# EAGLE design hybrid (EAGLE 7.7.0)

## Sheet 1 of 2
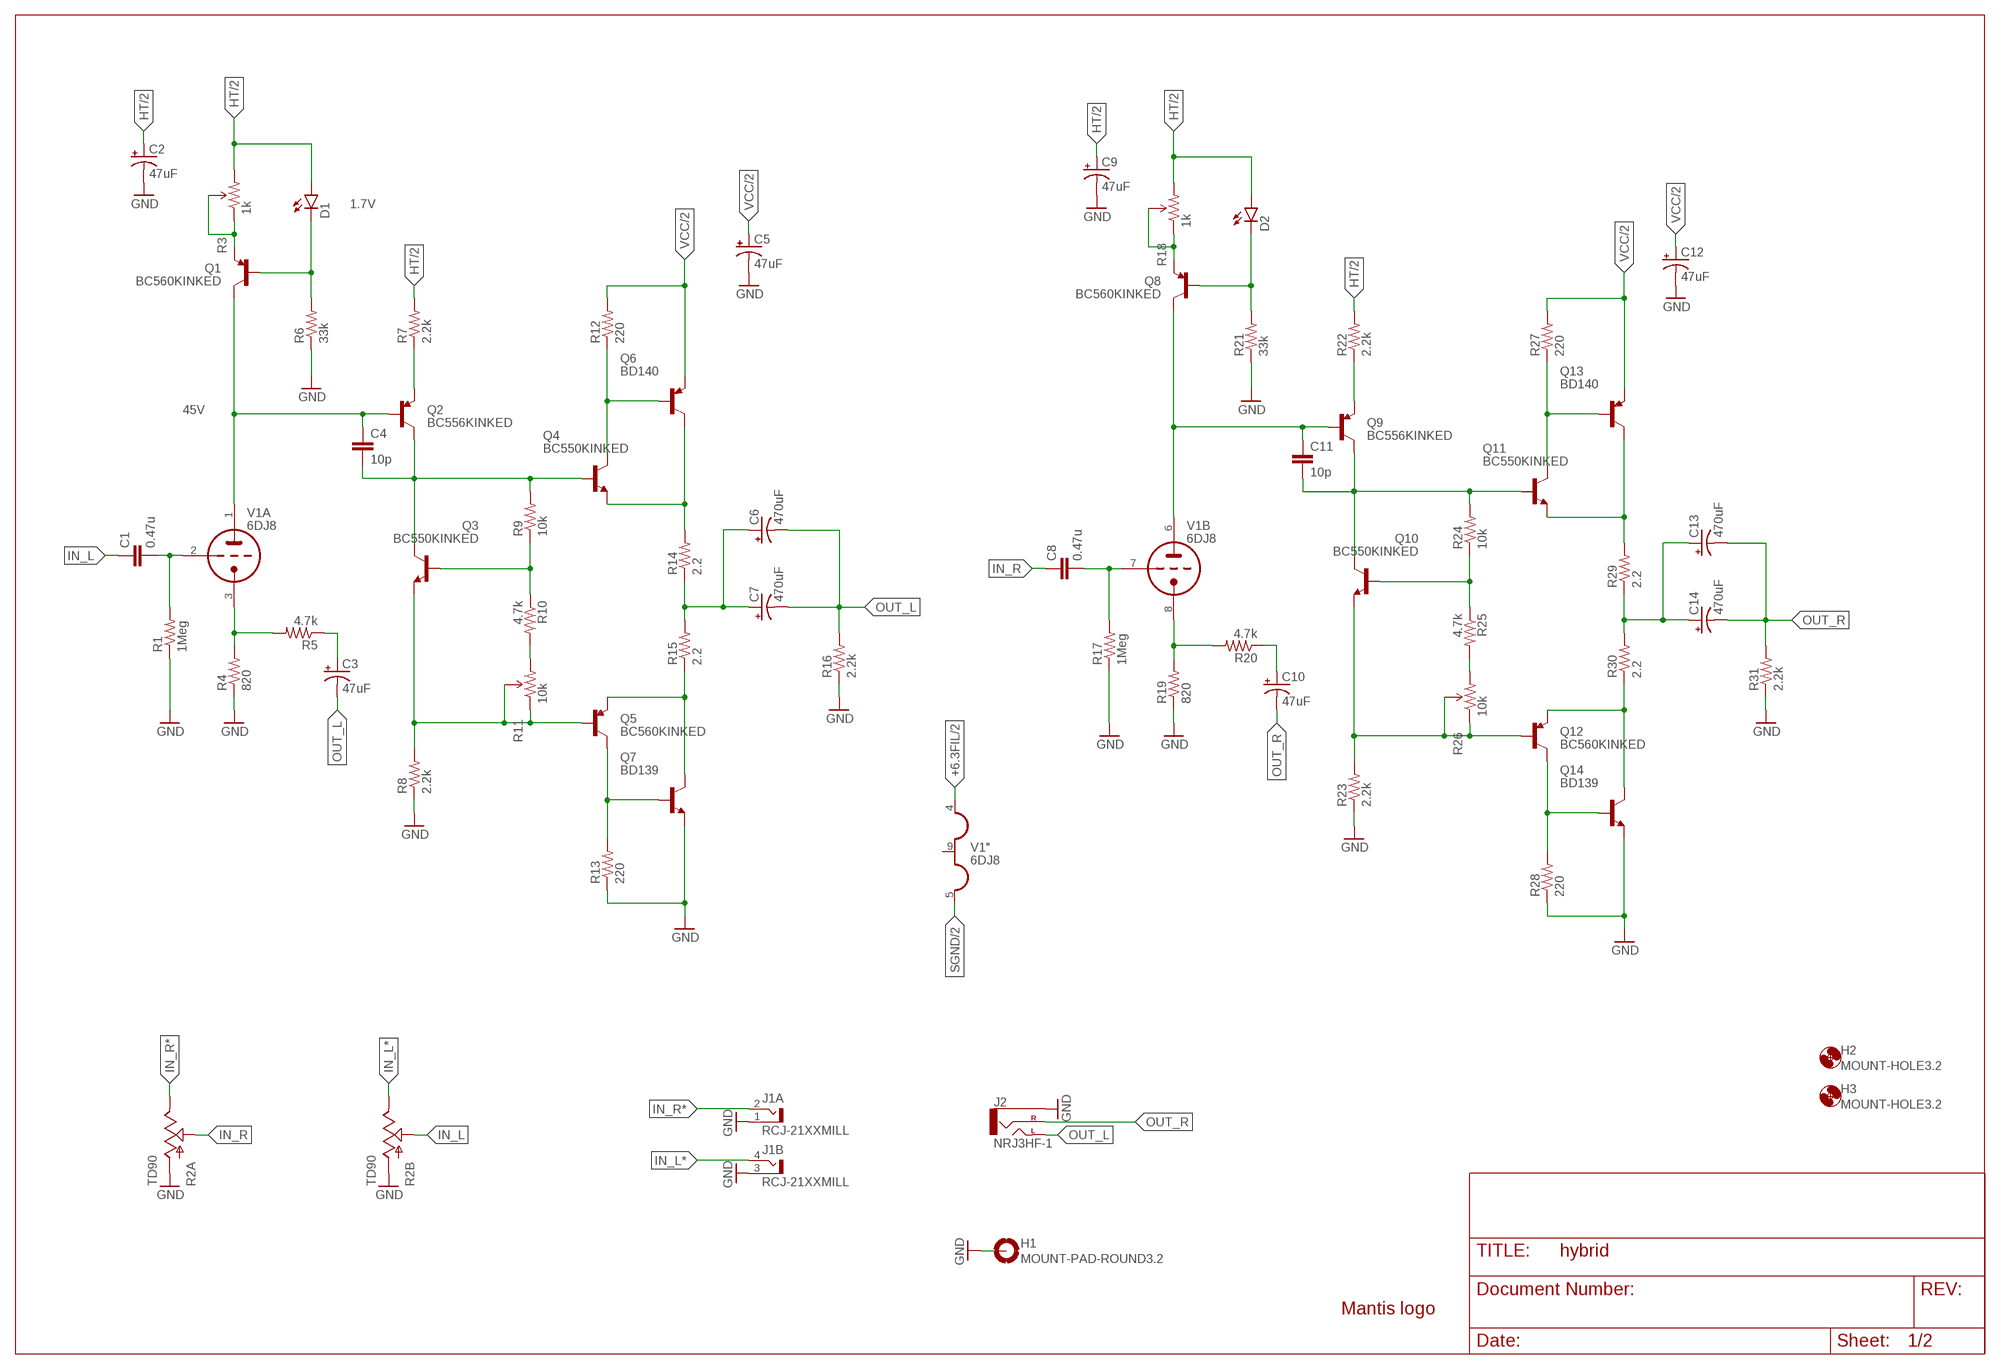
[diagram p0: schematic, sheet 1]

### Parts
C1  0.47u  C5/3.5  [C5B3.5]
C2  47uF  CAP_POLPTH-8/3.5  [CPOL-RADIAL-8/3.5]
C3  47uF  CAP_POLPTH-8/3.5  [CPOL-RADIAL-8/3.5]
C4  10p  CAPPTH  [CAP-PTH-SMALL]
C5  47uF  CAP_POLPTH-8/3.5  [CPOL-RADIAL-8/3.5]
C6  470uF  CAP_POLPTH-12/5  [CPOL-RADIAL-12/5]
C7  470uF  CAP_POLPTH-12/5  [CPOL-RADIAL-12/5]
C8  0.47u  C5/3.5  [C5B3.5]
C9  47uF  CAP_POLPTH-8/3.5  [CPOL-RADIAL-8/3.5]
C10  47uF  CAP_POLPTH-8/3.5  [CPOL-RADIAL-8/3.5]
C11  10p  CAPPTH  [CAP-PTH-SMALL]
C12  47uF  CAP_POLPTH-8/3.5  [CPOL-RADIAL-8/3.5]
C13  470uF  CAP_POLPTH-12/5  [CPOL-RADIAL-12/5]
C14  470uF  CAP_POLPTH-12/5  [CPOL-RADIAL-12/5]
D1  LED3MM  [LED3MM]
D2  LED3MM  [LED3MM]
H1  MOUNT-PAD-ROUND3.2  [3,2-PAD]
H2  MOUNT-HOLE3.2  [3,2]
H3  MOUNT-HOLE3.2  [3,2]
J1  RCJ-21XXMILL  [RCJ-21-MILL]
J2  NRJ3HF-1  [NRJ3HF]
LOGO1  LOGO-MANTIS  [LOGO-MANTIS]
Q1  BC560KINKED  [TO92-BENT]
Q2  BC556KINKED  [TO92-BENT]
Q3  BC550KINKED  [TO92-BENT]
Q4  BC550KINKED  [TO92-BENT]
Q5  BC560KINKED  [TO92-BENT]
Q6  BD140  [TO126]
Q7  BD139  [TO126]
Q8  BC560KINKED  [TO92-BENT]
Q9  BC556KINKED  [TO92-BENT]
Q10  BC550KINKED  [TO92-BENT]
Q11  BC550KINKED  [TO92-BENT]
Q12  BC560KINKED  [TO92-BENT]
Q13  BD140  [TO126]
Q14  BD139  [TO126]
R1  1Meg  RESISTORPTH-1/4W  [AXIAL-0.4]
R2  TD90  [PTD902]
R3  1k  TRIMPOT3362U-2  [3362U-2]
R4  820  RESISTORPTH-1/4W  [AXIAL-0.4]
R5  4.7k  RESISTORPTH-1/4W  [AXIAL-0.4]
R6  33k  RESISTORPTH-1/4W  [AXIAL-0.4]
R7  2.2k  RESISTORPTH-1/4W  [AXIAL-0.4]
R8  2.2k  RESISTORPTH-1/4W  [AXIAL-0.4]
R9  10k  RESISTORPTH-1/4W  [AXIAL-0.4]
R10  4.7k  RESISTORPTH-1/4W  [AXIAL-0.4]
R11  10k  TRIMPOT3362U-2  [3362U-2]
R12  220  RESISTORPTH-1/4W  [AXIAL-0.4]
R13  220  RESISTORPTH-1/4W  [AXIAL-0.4]
R14  2.2  RESISTORPTH-1/2W  [AXIAL-0.5]
R15  2.2  RESISTORPTH-1/2W  [AXIAL-0.5]
R16  2.2k  RESISTORPTH-1/4W  [AXIAL-0.4]
R17  1Meg  RESISTORPTH-1/4W  [AXIAL-0.4]
R18  1k  TRIMPOT3362U-2  [3362U-2]
R19  820  RESISTORPTH-1/4W  [AXIAL-0.4]
R20  4.7k  RESISTORPTH-1/4W  [AXIAL-0.4]
R21  33k  RESISTORPTH-1/4W  [AXIAL-0.4]
R22  2.2k  RESISTORPTH-1/4W  [AXIAL-0.4]
R23  2.2k  RESISTORPTH-1/4W  [AXIAL-0.4]
R24  10k  RESISTORPTH-1/4W  [AXIAL-0.4]
R25  4.7k  RESISTORPTH-1/4W  [AXIAL-0.4]
R26  10k  TRIMPOT3362U-2  [3362U-2]
R27  220  RESISTORPTH-1/4W  [AXIAL-0.4]
R28  220  RESISTORPTH-1/4W  [AXIAL-0.4]
R29  2.2  RESISTORPTH-1/2W  [AXIAL-0.5]
R30  2.2  RESISTORPTH-1/2W  [AXIAL-0.5]
R31  2.2k  RESISTORPTH-1/4W  [AXIAL-0.4]
V1  6DJ8  6DJ8-P  [NOVAL]

### Nets
+6.3FIL [pwr]: V1.4(":H1) ; also sheet 2
CAT_L: R4.P$2 R5.P$2 V1.3(A:TK)
CAT_R: R19.P$2 R20.P$2 V1.8(B:TK)
FB_L [out]: C6.+ C7.+ R14.P$1 R15.P$2
FB_R [out]: C13.+ C14.+ R29.P$1 R30.P$2
GND: C2.2(-) C5.2(-) C9.2(-) C12.2(-) H1.B3,2(MOUNT) J1.1(A:S) J1.3(B:S) J2.S(SLEEVE) Q7.1(E) Q14.1(E) R1.P$1 R2.R1.1(A:A) R2.R2.1(B:A) R4.P$1 R6.P$1 R8.P$1 R13.P$1 R16.P$1 R17.P$1 R19.P$1 R21.P$1 R23.P$1 R28.P$1 R31.P$1 ; also sheet 2
HT [pwr]: C2.1(+) C9.1(+) D1.A D2.A R3.3(CW) R7.P$2 R18.3(CW) R22.P$2 ; also sheet 2
IN_L: C1.1 R2.R2.2(B:S)
IN_L*: J1.4(B:T) R2.R2.3(B:E)
IN_R: C8.1 R2.R1.2(A:S)
IN_R*: J1.2(A:T) R2.R1.3(A:E)
N$2: Q1.3(E) R3.1(CCW) R3.2(WIPER)
N$3: D1.K(C) Q1.2(B) R6.P$2
N$4: C3.1(+) R5.P$1
N$5: Q2.3(E) R7.P$1
N$7: C4.2 Q2.1(C) Q3.1(C) Q4.2(B) R9.P$2
N$8: Q3.2(B) R9.P$1 R10.P$1
N$9: C1.2 R1.P$2 V1.2(A:TG)
N$10: R10.P$2 R11.3(CW)
N$11 [out]: Q4.3(E) Q6.2(C) R14.P$2
N$12: Q3.3(E) Q5.2(B) R8.P$2 R11.1(CCW) R11.2(WIPER)
N$13 [out]: Q5.3(E) Q7.2(C) R15.P$1
N$14: Q4.1(C) Q6.3(B) R12.P$1
N$15: Q5.1(C) Q7.3(B) R13.P$2
N$16: Q8.3(E) R18.1(CCW) R18.2(WIPER)
N$17: D2.K(C) Q8.2(B) R21.P$2
N$18: C8.2 R17.P$2 V1.7(B:TG)
N$19: C10.1(+) R20.P$1
N$20: Q9.3(E) R22.P$1
N$21: C11.2 Q9.1(C) Q10.1(C) Q11.2(B) R24.P$2
N$22: Q10.2(B) R24.P$1 R25.P$1
N$23: R25.P$2 R26.3(CW)
N$24: Q10.3(E) Q12.2(B) R23.P$2 R26.1(CCW) R26.2(WIPER)
N$25 [out]: Q11.3(E) Q13.2(C) R29.P$2
N$26 [out]: Q12.3(E) Q14.2(C) R30.P$1
N$27: Q11.1(C) Q13.3(B) R27.P$1
N$28: Q12.1(C) Q14.3(B) R28.P$2
OUT_L [out]: C3.2(-) C6.- C7.- J2.T(LEFT) R16.P$2
OUT_R [out]: C10.2(-) C13.- C14.- J2.R(RIGHT) R31.P$2
PL_L: C4.1 Q1.1(C) Q2.2(B) V1.1(A:TA)
PL_R: C11.1 Q8.1(C) Q9.2(B) V1.6(B:TA)
SGND [pwr]: V1.5(":H3) ; also sheet 2
VCC [pwr]: C5.1(+) C12.1(+) Q6.1(E) Q13.1(E) R12.P$2 R27.P$2 ; also sheet 2
Unconnected: V1.9(":H2)

### Notes on the sheet
- 1.7V
- 45V

## Sheet 2 of 2
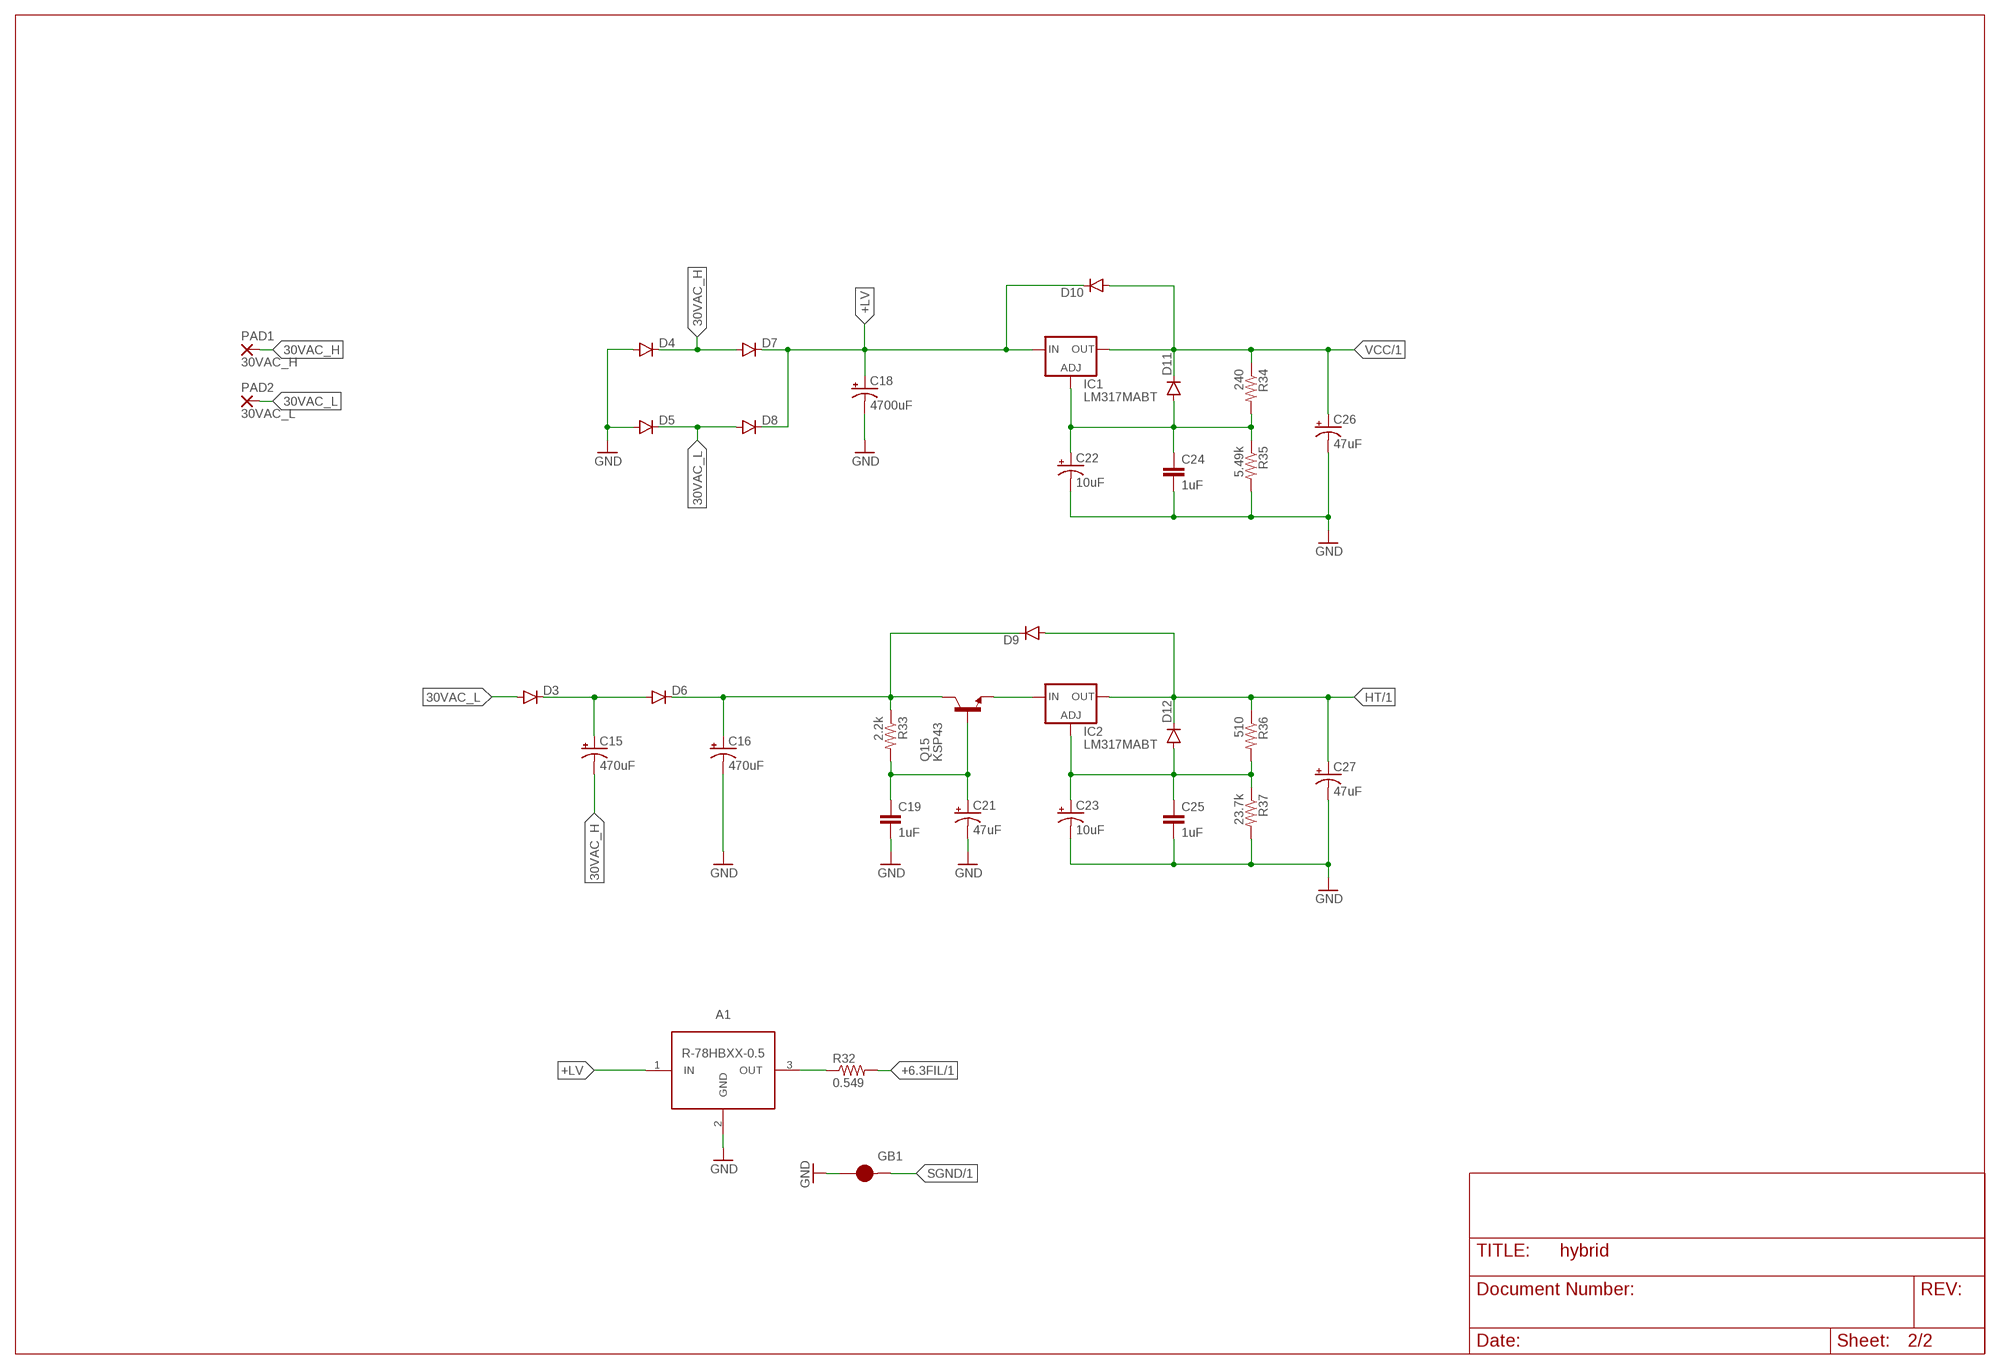
[diagram p1: schematic, sheet 2]

### Parts
A1  R-78HBXX-0.5  [R-78HB]
C15  470uF  CAP_POLPTH-16/7.5  [CPOL-RADIAL-16/7.5]
C16  470uF  CAP_POLPTH-16/7.5  [CPOL-RADIAL-16/7.5]
C18  4700uF  CAP_POLPTH-22/10  [CPOL-RADIAL-22/10]
C19  1uF  CAPPTH  [CAP-PTH-SMALL]
C21  47uF  CAP_POLPTH-12/5  [CPOL-RADIAL-12/5]
C22  10uF  CAP_POLPTH-5/2.5  [CPOL-RADIAL-5/2.5]
C23  10uF  CAP_POLPTH-6.5/2.5  [CPOL-RADIAL-6.5/2.5]
C24  1uF  CAPPTH  [CAP-PTH-SMALL]
C25  1uF  CAPPTH  [CAP-PTH-SMALL]
C26  47uF  CAP_POLPTH-8/3.5  [CPOL-RADIAL-8/3.5]
C27  47uF  CAP_POLPTH-8/3.5  [CPOL-RADIAL-8/3.5]
D3  DIODEPTH  [DIODE-1N4001]
D4  DIODEPTH  [DIODE-1N4001]
D5  DIODEPTH  [DIODE-1N4001]
D6  DIODEPTH  [DIODE-1N4001]
D7  DIODEPTH  [DIODE-1N4001]
D8  DIODEPTH  [DIODE-1N4001]
D9  DIODEPTH  [DIODE-1N4001]
D10  DIODEPTH  [DIODE-1N4001]
D11  DIODEPTH  [DIODE-1N4001]
D12  DIODEPTH  [DIODE-1N4001]
GB1  COPPER-BRIDGESM  [COPPER-BRIDGE-SM]
IC1  LM317MABT  [TO220L1]
IC2  LM317MABT  [TO220L1]
PAD1  30VAC_H  3,81/1,4  [3,81/1,4]
PAD2  30VAC_L  3,81/1,4  [3,81/1,4]
Q15  KSP43  [TO-92]
R32  0.549  RESISTORPTH-1/2W  [AXIAL-0.5]
R33  2.2k  RESISTORPTH-1/4W  [AXIAL-0.4]
R34  240  RESISTORPTH-1/4W  [AXIAL-0.4]
R35  5.49k  RESISTORPTH-1/4W  [AXIAL-0.4]
R36  510  RESISTORPTH-1/4W  [AXIAL-0.4]
R37  23.7k  RESISTORPTH-1/4W  [AXIAL-0.4]

### Nets
30VAC_H [pwr]: C15.2(-) D4.C D7.A PAD1.1(P)
30VAC_L [pwr]: D3.A D5.C D8.A PAD2.1(P)
+6.3FIL [pwr]: R32.P$2 ; also sheet 1
+LV [pwr]: A1.1(IN) C18.1(+) D7.C D8.C D10.C IC1.3(IN)
GND: A1.2(GND) C16.2(-) C18.2(-) C19.2 C21.- C22.2(-) C23.2(-) C24.2 C25.2 C26.2(-) C27.2(-) D4.A D5.A GB1.1 R35.P$2 R37.P$2 ; also sheet 1
HT [pwr]: C27.1(+) D9.A D12.C IC2.2(OUT) R36.P$1 ; also sheet 1
N$30: C22.1(+) C24.1 D11.A IC1.1(ADJ) R34.P$2 R35.P$1
N$31 [pwr]: C15.1(+) D3.C D6.A
N$32 [pwr]: A1.3(OUT) R32.P$1
N$33 [pwr]: C16.1(+) D6.C D9.C Q15.3(C) R33.P$1
N$34: C19.1 C21.+ Q15.2(B) R33.P$2
N$36: C23.1(+) C25.1 D12.A IC2.1(ADJ) R36.P$2 R37.P$1
N$37 [pwr]: IC2.3(IN) Q15.1(E)
SGND [pwr]: GB1.2 ; also sheet 1
VCC [pwr]: C26.1(+) D10.A D11.C IC1.2(OUT) R34.P$1 ; also sheet 1

## Library data of the parts
A1 = my-smps:R-78HBXX-0.5: The R-78HBxx-Series high efficiency, high input voltage switching regulators are ideally suited to replace 78xx linear regulators and are pin compatible. http://www.mouser.com/ds/2/468/R-78HBxx-0.5_L-958370.pdf
C1 C8 = capacitor-wima:C: CAPACITOR naming: grid - package width
C2 C3 C5-C7 C9 C10 C12-C16 C18 C21-C23 C26 C27 = my-cap:CAP_POL: Capacitor Polarized These are standard SMD and PTH capacitors. Normally 10uF, 47uF, and 100uF in electrolytic and tantalum varieties. Always verify the external diameter of the through hole cap, it varies with capacity, voltage, and manufacturer. The EIA devices should be standard.
C4 C11 C19 C24 C25 = SparkFun-Capacitors:CAP: Capacitor Standard 0603 ceramic capacitor, and 0.1" leaded capacitor.
D1 D2 = SparkFun-LED:LED: LEDs Standard schematic elements and footprints for 5mm, 3mm, 1206, and 0603 sized LEDs. 5mm - Spark Fun Electronics SKU : COM-00529 (and others); PROD_ID: DIO-08794
D3-D12 = SparkFun-DiscreteSemi:DIODE: Diode These are standard reverse protection diodes and small signal diodes. SMA package can handle up to about 1A. SOD-323 can handle about 200mA. What the SOD-323 package when ordering, there are some mfgs out there that are 5-pin packages.
GB1 = my:COPPER-BRIDGE
H1 = holes:MOUNT-PAD-ROUND: MOUNTING PAD, round
H2 H3 = holes:MOUNT-HOLE: MOUNTING HOLE with drill center marker
IC1 IC2 = v-reg:LM317?*: 500 mA Adjustable Output Positive Voltage Regulator Source: http://www.onsemi.co.jp .. LM317M-D.PDF
J1 = my:RCJ-21XX: Dual RCA Jack
J2 = my-conn:NRJ3HF-1: 1/4" Phone Jack
LOGO1 = my:LOGO-MANTIS: Mantis logo
PAD1 PAD2 = wirepad:3,81/1,4: THROUGH-HOLE PAD
Q1 Q5 Q8 Q12 = my-tran:BC560
Q2 Q9 = my-tran:BC556
Q3 Q4 Q10 Q11 = my-tran:BC550: NPN Epitaxial Silicon Transistor
Q6 Q13 = transistor-pnp:BD140: PNP Transistor
Q7 Q14 = transistor-npn:BD139*: NPN Transistor
Q15 = my-tran:KSP43
R1 R4-R10 R12-R17 R19-R25 R27-R31 R33-R37 = SparkFun-Resistors:RESISTOR: Resistor Basic schematic elements and footprints for 0603, 1206, and PTH resistors.
R2 = my:TD90: PTD90 Series - 9 mm Multi-Ganged Potentiometer
R3 R11 R18 R26 = SparkFun-Electromechanical:TRIMPOT: Various small potentiometers for "set-and-forget" applications
R32 = my-res:RESISTOR: Resistor Basic schematic elements and footprints for 0603, 1206, and PTH resistors.
V1 = tubes:6DJ8-P

## Net classes
1 out: width 0.813 mm
2 pwr: width 1.778 mm

## Board
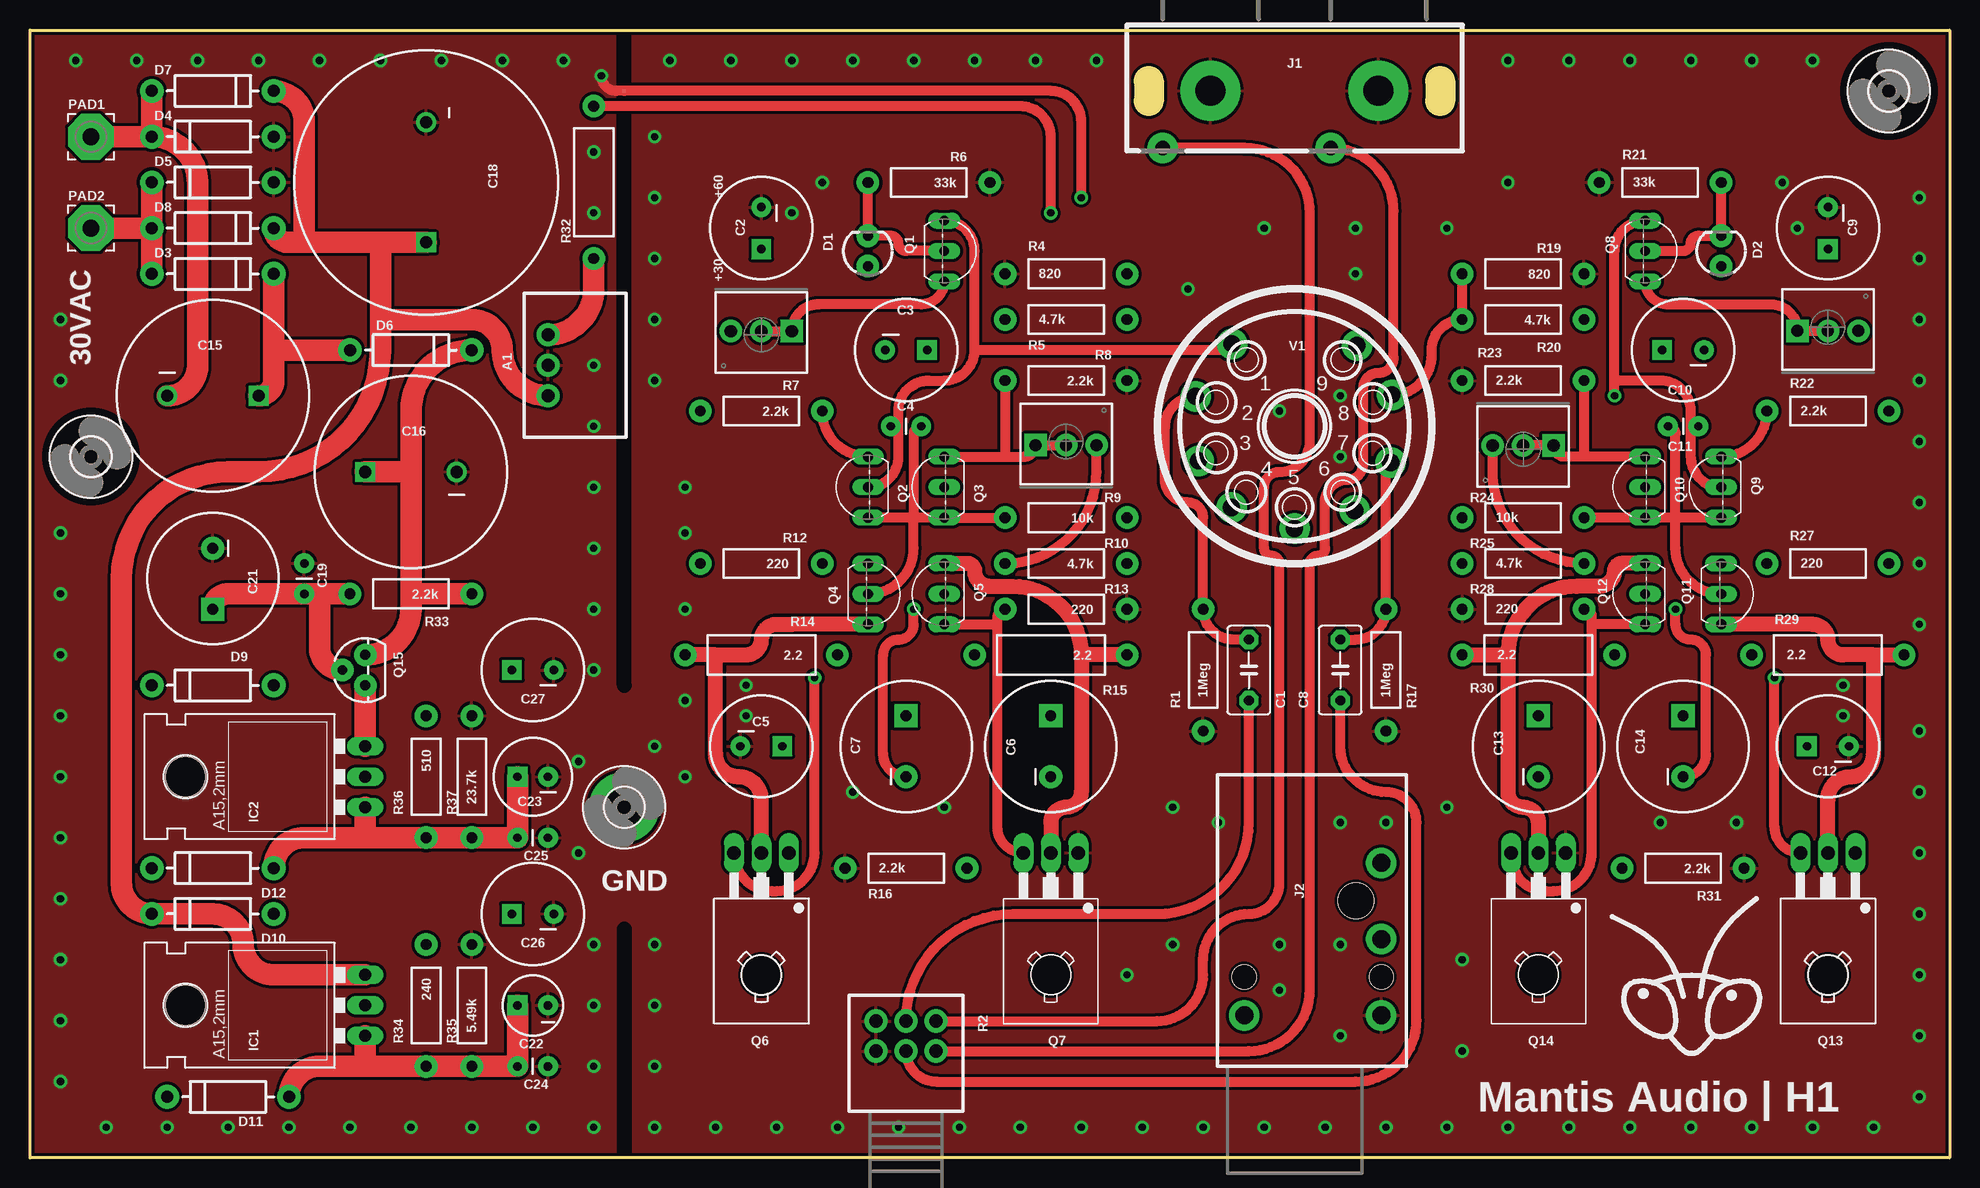
[diagram p2: board, top side]
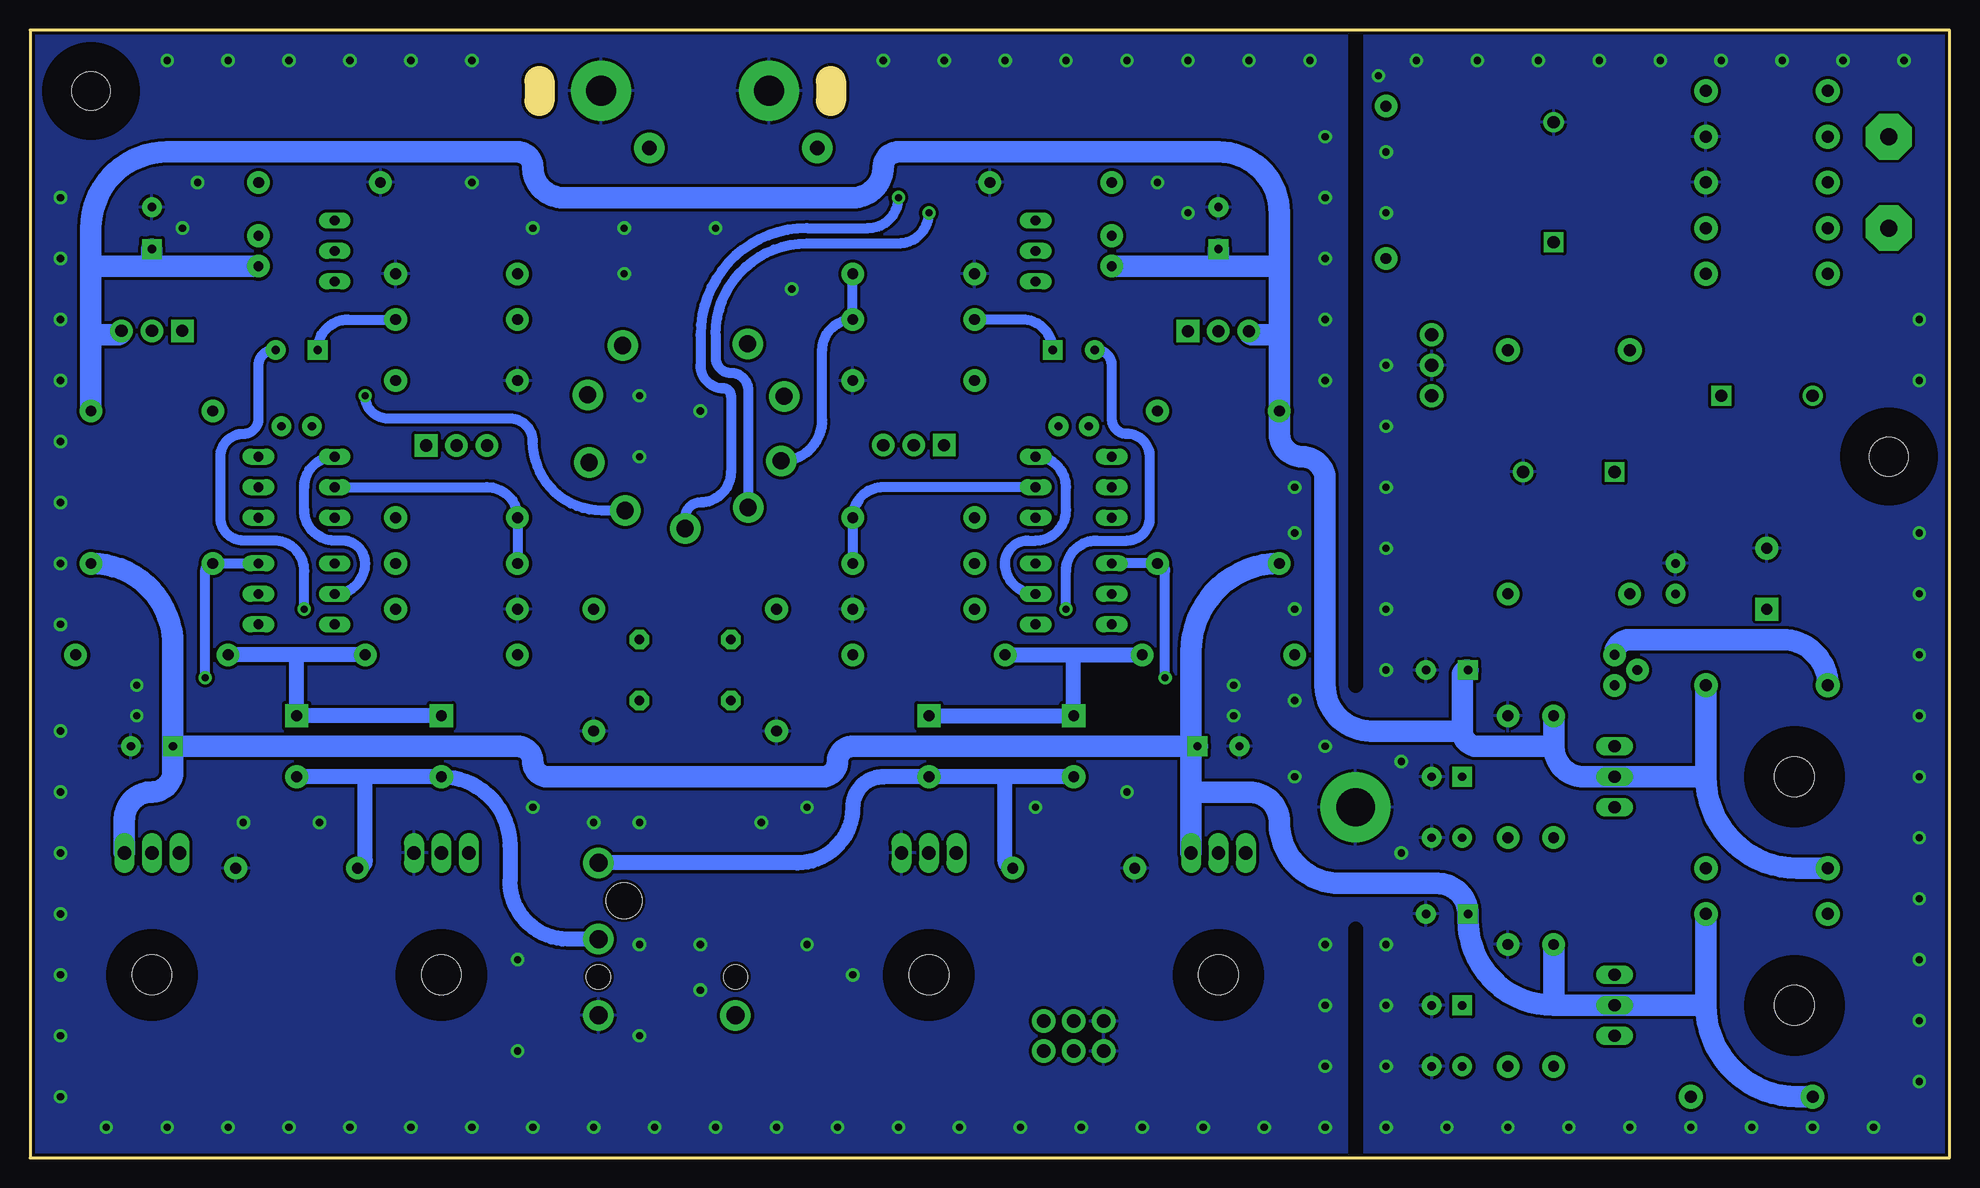
[diagram p3: board, bottom side, seen from below]

Size 160.02 x 93.98 mm. Coordinates in mm from the lower left corner, seen from the top.
Outline: 0,93.98 160.02,93.98 160.02,0 0,0 0,93.98
Copper layers (1*16): Top 0.035mm / dielectric 1.5mm / Bottom 0.035mm
Design rules "SeeedStudio_2layer_DRU_no_angle_20140221 *": minimum track width 10mil, minimum drill 12mil, track to track 10mil, track to pad 10mil, pad to pad 10mil, via to via 10mil, smd to smd 0mil, copper to edge 10mil, drill to drill 10mil, minimum pad ring 10mil, minimum via ring 10mil, stop-mask expansion 2mil, vias tented up to drill 100mil, thermal gap 10mil
tRestrict: 2 lines
bRestrict: 2 lines

### Footprints (pad centres in the part's own frame; a part is rotated, then mirrored left to right if it is on the bottom)
R-78HB = drill 1.1 pad 1.93: 1 -2.54,0; 2 0,0; 3 2.54,0
C5B3.5 = drill 0.813 pad 1.6 octagon: 1 -2.54,0; 2 2.54,0
CPOL-RADIAL-8/3.5 = drill 0.7 pad 1.651 square: 1 1.75,0 | drill 0.7 pad 1.651: 2 -1.75,0
CAP-PTH-SMALL = drill 0.7 pad 1.651: 1 0,0; 2 2.54,0
CPOL-RADIAL-12/5 = drill 0.9 pad 1.93 square: + 2.54,0 | drill 0.9 pad 1.93: - -2.54,0
CPOL-RADIAL-16/7.5 = drill 1.016 pad 1.651 square: 1 3.81,0 | drill 1.016 pad 1.676: 2 -3.81,0
CPOL-RADIAL-22/10 = drill 1.016 pad 1.651 square: 1 5,0 | drill 1.016 pad 1.676: 2 -5,0
CPOL-RADIAL-5/2.5 = drill 0.7 pad 1.651 square: 1 1.27,0 | drill 0.7 pad 1.651: 2 -1.27,0
CPOL-RADIAL-6.5/2.5 = drill 0.7 pad 1.651 square: 1 1.27,0 | drill 0.7 pad 1.651: 2 -1.27,0
LED3MM = drill 0.813 pad 1.88: A -1.27,0; K 1.27,0
DIODE-1N4001 = drill 1 pad 1.981: A -5.08,0; C 5.08,0
COPPER-BRIDGE-SM = smd 0.203 x 0.203: 1 0,0; 2 0,0
3,2-PAD = drill 3.2 pad 5.842: B3,2 0,0
3,2 = hole 3.2: 0,0
TO220L1 = drill 1.016 long: 1 -2.54,-3.81; 2 0,-3.81; 3 2.54,-3.81 | hole 3.302: 0,11.176
RCJ-21-MILL = drill 2.5 pad 5: 1 7,0; 3 -7,0 | drill 1.2 pad 2.54: 2 3,-4.75; 4 -11,-4.75
NRJ3HF = drill 1.5 pad 2.54: G -4.25,-4.2; R -10.6,7.23; S -4.25,7.23; T -16.95,7.23 | hole 2: -7.45,7.23; -7.45,-4.2 | hole 3: -13.8,5.1
3,81/1,4 = drill 1.397 pad 3.81 octagon: 1 0,0
TO92-BENT = drill 0.813 long: 1 -2.54,-1.27; 2 0,-1.27; 3 2.54,-1.27
TO126 = drill 1.118 long: 1 -2.286,-5.08; 2 0,-5.08; 3 2.286,-5.08 | hole 3.302: 0,5.08
TO-92 = drill 0.813 pad 1.88: 1 -1.27,0; 2 0,1.905; 3 1.27,0
AXIAL-0.4 = drill 0.9 pad 1.88: P$1 -5.08,0; P$2 5.08,0
PTD902 = drill 1.1 pad 1.93: R1.1 0,-2.5; R1.2 0,0; R1.3 0,2.5; R2.1 -2.5,-2.5; R2.2 -2.5,0; R2.3 -2.5,2.5
3362U-2 = drill 1.016 pad 1.88 square: 1 -2.54,-0.305 | drill 1.016 pad 1.88: 2 0,-0.305; 3 2.54,-0.305
AXIAL-0.5 = drill 0.9 pad 1.88: P$1 -6.35,0; P$2 6.35,0
NOVAL = drill 1.422 pad 2.54: 1 5.207,-6.858; 2 8.254,-2.484; 3 8.004,2.893; 4 5.258,6.77; 5 0,8.524; 6 -5.004,7.024; 7 -8.004,3.02; 8 -8.127,-2.611; 9 -5.207,-6.731

### Placement (x,y rotation side)
A1  43.18,66.04 90 top
C1  101.6,40.64 90 top
C2  60.96,77.47 270 top
C3  73.03,67.31 0 top
C4  71.75,60.96 0 top
C5  60.96,34.29 0 top
C6  85.09,34.29 90 top
C7  73.03,34.29 90 top
C8  109.22,40.64 90 top
C9  149.86,77.47 270 top
C10  137.79,67.31 180 top
C11  139.06,60.96 180 top
C12  149.86,34.29 180 top
C13  125.73,34.29 90 top
C14  137.79,34.29 90 top
C15  15.24,63.5 0 top
C16  31.75,57.15 180 top
C18  33.02,81.28 270 top
C19  22.86,46.99 90 top
C21  15.24,48.26 270 top
C22  41.91,12.7 180 top
C23  41.91,31.75 180 top
C24  40.64,7.62 0 top
C25  40.64,26.67 0 top
C26  41.91,20.32 180 top
C27  41.91,40.64 180 top
D1  69.85,75.56 90 top
D2  140.97,75.56 90 top
D3  15.24,73.66 0 top
D4  15.24,85.09 180 top
D5  15.24,81.28 180 top
D6  31.75,67.31 0 top
D7  15.24,88.9 0 top
D8  15.24,77.47 0 top
D9  15.24,39.37 180 top
D10  15.24,20.32 180 top
D11  16.51,5.08 180 top
D12  15.24,24.13 180 top
GB1  49.53,88.9 0 top
H1  49.53,29.21 0 top
H2  154.94,88.9 0 top
H3  5.08,58.42 0 top
IC1  24.13,12.7 90 top
IC2  24.13,31.75 90 top
J1  105.41,88.9 0 top
J2  105.41,7.62 270 top
LOGO1  138.43,15.24 0 top
PAD1  5.08,85.09 0 top
PAD2  5.08,77.47 0 top
Q1  77.47,75.56 270 top
Q2  68.58,55.88 90 top
Q3  74.93,55.88 90 top
Q4  71.12,46.99 270 top
Q5  74.93,46.99 90 top
Q6  60.96,20.32 180 top
Q7  85.09,20.32 180 top
Q8  135.89,75.56 270 top
Q9  139.7,55.88 90 top
Q10  133.35,55.88 90 top
Q11  142.24,46.99 270 top
Q12  133.35,46.99 90 top
Q13  149.86,20.32 180 top
Q14  125.73,20.32 180 top
Q15  27.94,40.64 90 top
R1  97.79,40.64 90 top
R2  73.03,8.89 270 top
R3  60.96,68.58 180 top
R4  86.36,73.66 0 top
R5  86.36,69.85 0 top
R6  74.93,81.28 180 top
R7  60.96,62.23 180 top
R8  86.36,64.77 180 top
R9  86.36,53.34 180 top
R10  86.36,49.53 180 top
R11  86.36,59.69 0 top
R12  60.96,49.53 180 top
R13  86.36,45.72 180 top
R14  60.96,41.91 180 top
R15  85.09,41.91 180 top
R16  73.03,24.13 0 top
R17  113.03,40.64 90 top
R18  149.86,69.22 0 top
R19  124.46,73.66 180 top
R20  124.46,69.85 180 top
R21  135.89,81.28 0 top
R22  149.86,62.23 0 top
R23  124.46,64.77 0 top
R24  124.46,53.34 0 top
R25  124.46,49.53 0 top
R26  124.46,59.05 180 top
R27  149.86,49.53 0 top
R28  124.46,45.72 0 top
R29  149.86,41.91 0 top
R30  125.73,41.91 0 top
R31  137.79,24.13 180 top
R32  46.99,81.28 90 top
R33  31.75,46.99 180 top
R34  33.02,12.7 270 top
R35  36.83,12.7 90 top
R36  33.02,31.75 270 top
R37  36.83,31.75 90 top
V1  105.41,60.96 180 top

### Tracks (layer width: path | path; a pad name or v marks a point on that pad's centre or on a via)
30VAC_H
  Top 1.778: PAD1.1 D4.C | D4.C D7.A | D4.C arc-90 13.97,81.28 13.97,66.04 arc-90 C15.2
30VAC_L
  Top 1.778: PAD2.1 D8.A | D8.A D5.C | D8.A D3.A
+6.3FIL  (via drill 0.6)
  Top 0.813: R32.P$2 82.55,87.63 arc-90 85.09,85.09 v85.09,78.74
  Bottom 0.813: v85.09,78.74 arc90 87.63,76.2 95.25,76.2 arc-90 102.87,68.58 102.87,66.67 arc-90 101.6,65.41 arc90 100.15,63.96 V1.4
+LV
  Top 1.778: C18.1 29.21,76.28 | 29.21,76.28 22.86,76.28 | 22.86,76.28 21.51,76.28 arc-90 D8.C | D7.C arc-90 22.86,86.36 22.86,76.28 | 29.21,69.85 29.21,67.31 arc-90 19.05,57.15 16.51,57.15 arc90 7.62,48.26 7.62,22.86 arc90 D10.C 15.24,20.32 arc-90 17.78,17.78 arc90 20.32,15.24 IC1.3 | 29.21,69.85 29.21,76.28 | A1.1 arc-90 39.37,67.31 arc90 36.83,69.85 29.21,69.85
CAT_L
  Bottom 0.813: R4.P$2 R5.P$2 arc-90 93.98,67.31 93.98,61.49 arc90 V1.3
CAT_R
  Top 0.813: R19.P$2 R20.P$2 arc90 116.84,67.31 116.84,66.87 arc-90 V1.8
FB_L
  Bottom 1.27: C6.+ C7.+ 73.03,41.91 | R15.P$2 73.03,41.91 | 73.03,41.91 R14.P$1
FB_R
  Bottom 1.27: C13.+ C14.+ 137.79,41.91 | R30.P$2 137.79,41.91 | 137.79,41.91 R29.P$1
GND  (via drill 0.6)
  Top 0.813: GB1.1 48.9,88.9 arc-90 v47.62,90.17
  other vias: 2.54,52.07 2.54,46.99 2.54,41.91 2.54,36.83 2.54,31.75 2.54,26.67 2.54,21.59 2.54,16.51 2.54,11.43 2.54,6.35 6.35,2.54 11.43,2.54 16.51,2.54 21.59,2.54 26.67,2.54 31.75,2.54 36.83,2.54 41.91,2.54 46.99,2.54 46.99,7.62 46.99,12.7 46.99,17.78 45.72,33.02 45.72,25.4 52.07,34.29 54.61,31.75 52.07,17.78 52.07,12.7 52.07,7.62 52.07,2.54 46.99,40.64 46.99,45.72 46.99,50.8 46.99,55.88 46.99,60.96 46.99,66.04 46.99,78.74 46.99,83.82 44.45,91.44 39.37,91.44 34.29,91.44 29.21,91.44 24.13,91.44 19.05,91.44 13.97,91.44 8.89,91.44 3.81,91.44 2.54,64.77 2.54,69.85 57.15,2.54 62.23,2.54 67.31,2.54 72.39,2.54 77.47,2.54 82.55,2.54 87.63,2.54 92.71,2.54 97.79,2.54 102.87,2.54 107.95,2.54 113.03,2.54 118.11,2.54 123.19,2.54 128.27,2.54 133.35,2.54 138.43,2.54 143.51,2.54 148.59,2.54 153.67,2.54 157.48,5.08 157.48,10.16 157.48,15.24 157.48,20.32 157.48,25.4 157.48,30.48 157.48,35.56 157.48,44.45 157.48,49.53 157.48,54.61 157.48,59.69 157.48,64.77 157.48,69.85 157.48,74.93 157.48,80.01 148.59,91.44 143.51,91.44 138.43,91.44 133.35,91.44 128.27,91.44 123.19,91.44 88.9,91.44 83.82,91.44 78.74,91.44 73.66,91.44 68.58,91.44 63.5,91.44 58.42,91.44 53.34,91.44 52.07,85.09 52.07,80.01 52.07,74.93 52.07,69.85 52.07,64.77 54.61,55.88 54.61,52.07 54.61,45.72 54.61,38.1 66.04,81.28 96.52,72.39 102.87,77.47 110.49,77.47 110.49,73.66 104.14,62.23 109.22,63.5 109.22,58.42 118.11,77.47 123.19,81.28 68.58,30.48 76.2,29.21 95.25,29.21 99.06,27.94 109.22,27.94 113.03,27.94 118.11,29.21 95.25,17.78 91.44,15.24 104.14,17.78 104.14,13.97 109.22,17.78 109.22,10.16 119.38,8.89 119.38,16.51 135.89,27.94 142.24,27.94 151.13,36.83 151.13,39.37 59.69,36.83 59.69,39.37 63.5,78.74 146.05,81.28 147.32,77.47
  pour Top: 0,93.98 160.02,93.98 160.02,0 0,0
  pour Bottom: 0,93.98 160.02,93.98 160.02,0 0,0
HT
  Bottom 1.778: 154.94,74.3 154.94,77.47 arc90 148.59,83.82 119.38,83.82 arc90 118.11,82.55 arc-90 115.57,80.01 91.44,80.01 arc-90 88.9,82.55 arc90 87.63,83.82 60.96,83.82 arc90 55.88,78.74 55.88,74.3 | 154.94,74.3 154.94,68.58 | 154.94,68.58 R22.P$2 | D1.A 60.96,74.3 | C2.1 60.96,74.3 | D2.A 149.86,74.3 | 149.86,74.3 154.94,74.3 | C9.1 149.86,74.3 | 55.88,74.3 55.88,68.58 | 55.88,68.58 R7.P$2 55.88,60.33 arc-90 53.98,58.42 arc90 52.07,56.52 52.07,39.37 arc-90 48.26,35.56 40.64,35.56 | 60.96,74.3 55.88,74.3 | R3.3 arc-90 58.12,68.58 55.88,68.58 | 154.94,68.58 152.73,68.58 arc-90 R18.3 | D12.C 12.7,24.13 arc90 20.32,31.75 | 20.32,31.75 D9.A | 20.32,31.75 IC2.2 30.48,31.75 arc90 33.02,34.29 | 33.02,34.29 R36.P$1 | 40.64,35.56 arc-90 39.37,34.29 33.02,34.29 | 40.64,35.56 40.64,40.16 arc90 C27.1
IN_L
  Top 0.813: R2.R2.2 arc-90 81.95,20.32 93.98,20.32 arc90 101.6,27.94 C1.1
IN_L*
  Top 0.813: R2.R2.3 93.94,11.39 arc90 97.79,15.24 97.79,16.51 arc-90 101.6,20.32 arc90 104.14,22.86 104.14,49.53 arc90 103.5,50.16 arc-90 102.87,50.8 102.87,55.88 arc-90 104.14,57.15 arc90 106.68,59.69 106.68,78.74 arc90 101.27,84.15 J1.4
IN_R
  Top 0.813: R2.R1.2 arc90 75.56,6.35 110.49,6.35 arc90 115.57,11.43 115.57,27.94 arc90 113.03,30.48 arc-90 109.22,34.29 C8.1
IN_R*
  Top 0.813: R2.R1.3 101.6,8.89 arc90 106.68,13.97 106.68,49.53 arc-90 107.31,50.16 arc90 107.95,50.8 107.95,54.61 arc-90 109.86,56.52 arc90 111.12,57.78 111.12,64.14 arc-90 112.39,65.41 arc90 113.67,66.67 113.67,78.89 arc90 J1.2
N$2
  Top 0.813: Q1.3 arc-90 74.3,71.12 65.73,71.12 arc90 R3.1 R3.2
N$3
  Top 0.813: Q1.2 73.03,75.56 arc-90 72.39,76.2 arc90 71.75,76.83 D1.K R6.P$2
N$4
  Bottom 0.813: C3.1 arc-90 77.31,69.85 R5.P$1
N$5
  Top 0.813: Q2.3 arc-90 R7.P$1
N$7
  Top 0.813: 73.66,53.34 Q2.1 | 73.66,53.34 Q3.1 R9.P$2 | C4.2 arc90 73.66,60.33 73.66,53.34 | Q4.2 arc90 73.66,50.8 73.66,53.34
N$8
  Bottom 0.813: Q3.2 88.9,55.88 arc-90 R9.P$1 R10.P$1
N$9
  Top 0.813: C1.2 100.33,43.18 arc-90 R1.P$2 97.79,53.34 arc90 96.52,54.61 arc-90 94.61,56.52 94.61,60.9 arc-90 V1.2
N$10
  Top 0.813: R10.P$2 arc90 88.9,57.15 R11.3
N$11
  Top 1.27: Q4.3 63.5,44.45 62.23,44.45 arc90 60.96,43.18 arc-90 59.69,41.91 57.15,41.91 | Q6.2 60.96,29.84 arc90 59.05,31.75 arc-90 57.15,33.66 57.15,41.91 | 57.15,41.91 R14.P$2
N$12
  Top 0.813: R11.2 R11.1 arc-90 82.86,58.42 81.28,58.42 | R8.P$2 81.28,58.42 | Q3.3 81.28,58.42
  Bottom 0.813: Q5.2 arc90 78.74,49.53 arc90 76.83,51.44 76.2,51.44 arc-90 73.66,53.98 73.66,55.88 arc-90 Q3.3
N$13
  Top 1.27: Q5.3 78.11,49.53 arc-90 78.74,48.9 arc90 80.01,47.62 81.92,47.62 arc-90 87.63,41.91 | 87.63,41.91 87.63,30.48 arc-90 86.36,29.21 arc90 85.09,27.94 Q7.2 | R15.P$1 87.63,41.91
N$14  (via drill 0.6)
  Top 0.813: Q6.3 arc90 61.85,22.23 62.23,22.23 arc90 65.41,25.4 v65.41,40.01
  Bottom 0.813: v65.41,40.01 65.41,48.9 arc-90 R12.P$1 Q4.1
N$15
  Top 0.813: Q7.3 arc-90 80.64,27.56 80.64,44.45 | 80.64,44.45 80.64,45.09 arc-90 R13.P$2 | Q5.1 80.64,44.45
N$16
  Top 0.813: Q8.3 arc90 136.53,71.12 145.11,71.12 arc-90 R18.1 R18.2
N$17
  Top 0.813: Q8.2 137.79,75.56 arc90 138.43,76.2 arc-90 139.06,76.83 D2.K R21.P$2
N$18
  Top 0.813: C8.2 110.49,43.18 arc90 R17.P$2 113.03,57.56 arc-90 V1.7
N$19
  Bottom 0.813: C10.1 arc90 133.5,69.85 R20.P$1
N$20
  Top 0.813: Q9.3 arc90 R22.P$1
N$21
  Top 0.813: Q9.1 137.16,53.34 | 137.16,53.34 Q10.1 R24.P$2 | Q11.2 arc-90 137.16,50.8 137.16,53.34 | 137.16,53.34 137.16,60.33 arc90 C11.2
N$22
  Bottom 0.813: Q10.2 121.92,55.88 arc90 R24.P$1 R25.P$1
N$23
  Top 0.813: R25.P$2 arc-90 121.92,57.15 R26.3
N$24
  Top 0.813: R26.2 R26.1 arc90 127.94,58.42 129.54,58.42 | R23.P$2 129.54,58.42 | Q10.3 129.54,58.42
  Bottom 0.813: Q12.2 arc-90 132.08,49.53 arc-90 133.99,51.44 134.62,51.44 arc90 137.16,53.98 137.16,55.88 arc90 Q10.3
N$25
  Top 1.27: Q13.2 149.86,29.84 arc-90 151.76,31.75 arc90 153.67,33.66 153.67,41.91 | 153.67,41.91 R29.P$2 | 153.67,41.91 151.13,41.91 arc-90 149.86,43.18 arc90 148.59,44.45 Q11.3
N$26
  Top 1.27: Q12.3 132.72,49.53 arc90 132.08,48.9 arc-90 130.81,47.62 128.91,47.62 arc90 123.19,41.91 | 123.19,41.91 123.19,30.48 arc90 124.46,29.21 arc-90 125.73,27.94 Q14.2 | R30.P$1 123.19,41.91
N$27  (via drill 0.6)
  Top 0.813: v145.41,40.01 145.41,27.56 arc90 Q13.3
  Bottom 0.813: v145.41,40.01 145.41,48.9 arc90 R27.P$1 Q11.1
N$28
  Top 0.813: Q14.3 123.44,25.15 arc90 126.36,22.23 127,22.23 arc90 130.18,25.4 130.18,44.45 | 130.18,44.45 130.18,45.09 arc90 R28.P$2 | Q12.1 130.18,44.45
N$30
  Top 1.778: D11.A arc-90 24.13,7.62 27.94,7.62 | 27.94,7.62 R34.P$2 R35.P$1 C24.1 C22.1 | IC1.1 27.94,7.62
N$31
  Top 1.778: D3.C 20.32,67.31 | 20.32,67.31 20.32,64.77 arc-90 C15.1 | D6.A 20.32,67.31
N$32
  Top 1.778: A1.3 arc90 46.99,72.39 R32.P$1
N$33
  Top 1.778: D6.C arc90 31.75,62.23 31.75,57.15 | 31.75,57.15 31.75,46.99 | 31.75,46.99 31.75,45.72 arc-90 Q15.3 | R33.P$1 31.75,46.99 | C16.1 31.75,57.15
  Bottom 1.778: Q15.3 arc90 26.67,43.18 13.97,43.18 arc90 D9.C
N$34
  Top 1.778: C21.+ arc-90 16.51,46.99 C19.1 24.13,46.99 | R33.P$2 24.13,46.99 | Q15.2 arc-90 24.13,42.55 24.13,46.99
N$36
  Top 1.778: D12.A arc-90 22.86,26.67 27.94,26.67 | 27.94,26.67 R36.P$2 R37.P$1 C25.1 C23.1 | IC2.1 27.94,26.67
N$37
  Top 1.778: Q15.1 IC2.3
OUT_L  (via drill 0.6)
  Top 0.813: C7.- arc-90 71.12,33.66 71.12,41.91 arc-90 72.39,43.18 arc90 73.66,44.45 v73.66,45.72
  Bottom 0.813: v73.66,45.72 73.66,48.9 arc90 71.12,51.44 68.58,51.44 arc-90 66.67,53.34 66.67,58.42 arc-90 68.58,60.33 arc90 69.85,61.59 69.85,66.04 arc-90 71.12,67.31 C3.2
  Bottom 1.27: C7.- 78.74,31.75 | 78.74,31.75 C6.- 88.9,31.75 arc-90 91.44,29.21 arc90 96.08,24.57 J2.T | R16.P$2 arc90 78.74,24.77 78.74,31.75
OUT_R  (via drill 0.6)
  Top 0.813: C14.- arc90 139.7,33.66 139.7,41.91 arc90 138.43,43.18 arc-90 137.16,44.45 v137.16,45.72
  Bottom 0.813: v137.16,45.72 137.16,48.9 arc-90 139.7,51.44 142.24,51.44 arc90 144.15,53.34 144.15,58.42 arc90 142.24,60.33 arc-90 140.97,61.59 140.97,66.04 arc90 139.7,67.31 C10.2
  Bottom 1.27: 132.08,31.75 C13.- arc90 120.02,26.04 120.02,23.05 arc-90 115.18,18.22 J2.R | 132.08,31.75 C14.- | R31.P$2 arc-90 132.08,24.77 132.08,31.75
PL_L
  Top 0.813: Q2.2 arc90 72.39,58.42 72.39,60.96 | 72.39,60.96 72.39,62.23 arc-90 74.93,64.77 76.2,64.77 arc90 78.74,67.31 | 78.74,67.31 78.74,75.56 arc90 Q1.1 | V1.1 arc-90 99.69,67.31 78.74,67.31 | C4.1 72.39,60.96
PL_R  (via drill 0.6)
  Top 0.813: Q9.2 arc-90 138.43,58.42 138.43,60.96 | 138.43,60.96 138.43,62.23 arc90 135.89,64.77 132.08,64.77 | v132.08,63.5 132.08,64.77 | 132.08,64.77 132.08,75.56 arc-90 Q8.1 | C11.1 138.43,60.96
  Bottom 0.813: V1.6 112.36,53.94 arc90 118.11,59.69 arc-90 120.02,61.59 130.18,61.59 arc90 v132.08,63.5
SGND  (via drill 0.6)
  Top 0.813: v87.63,80.01 87.63,86.36 arc90 85.09,88.9 GB1.2
  Bottom 0.813: v87.63,80.01 arc90 90.17,77.47 95.25,77.47 arc-90 104.14,68.58 104.14,66.04 arc-90 102.23,64.14 arc90 101.6,63.5 101.6,57.15 arc90 104.14,54.61 arc-90 105.41,53.34 V1.5
VCC
  Bottom 1.778: C12.1 119.38,34.29 arc90 118.11,33.02 arc-90 116.84,31.75 93.98,31.75 arc-90 92.71,33.02 arc90 91.44,34.29 63.25,34.29 | C12.1 148.11,32.23 arc90 149.86,30.48 arc-90 152.15,28.19 Q13.1 | C12.1 148.11,42.7 arc-90 R27.P$2 | D11.C 12.7,5.08 arc90 20.32,12.7 | 20.32,12.7 D10.A | 20.32,12.7 IC1.2 33.02,12.7 | 33.02,12.7 arc90 40.16,19.84 C26.1 arc-90 42.7,22.86 50.8,22.86 arc90 55.88,27.94 arc-90 58.42,30.48 63.25,30.48 | R34.P$1 33.02,12.7 | R12.P$2 arc-90 63.25,42.16 63.25,34.29 | 63.25,34.29 63.25,30.48 | 63.25,30.48 Q6.1 | C5.1 63.25,34.29

### Text on the board
tPlace: +60 | +30 | 30VAC | GND | Mantis Audio | H1